# EAGLE design vfddriver (EAGLE 9.5.0)
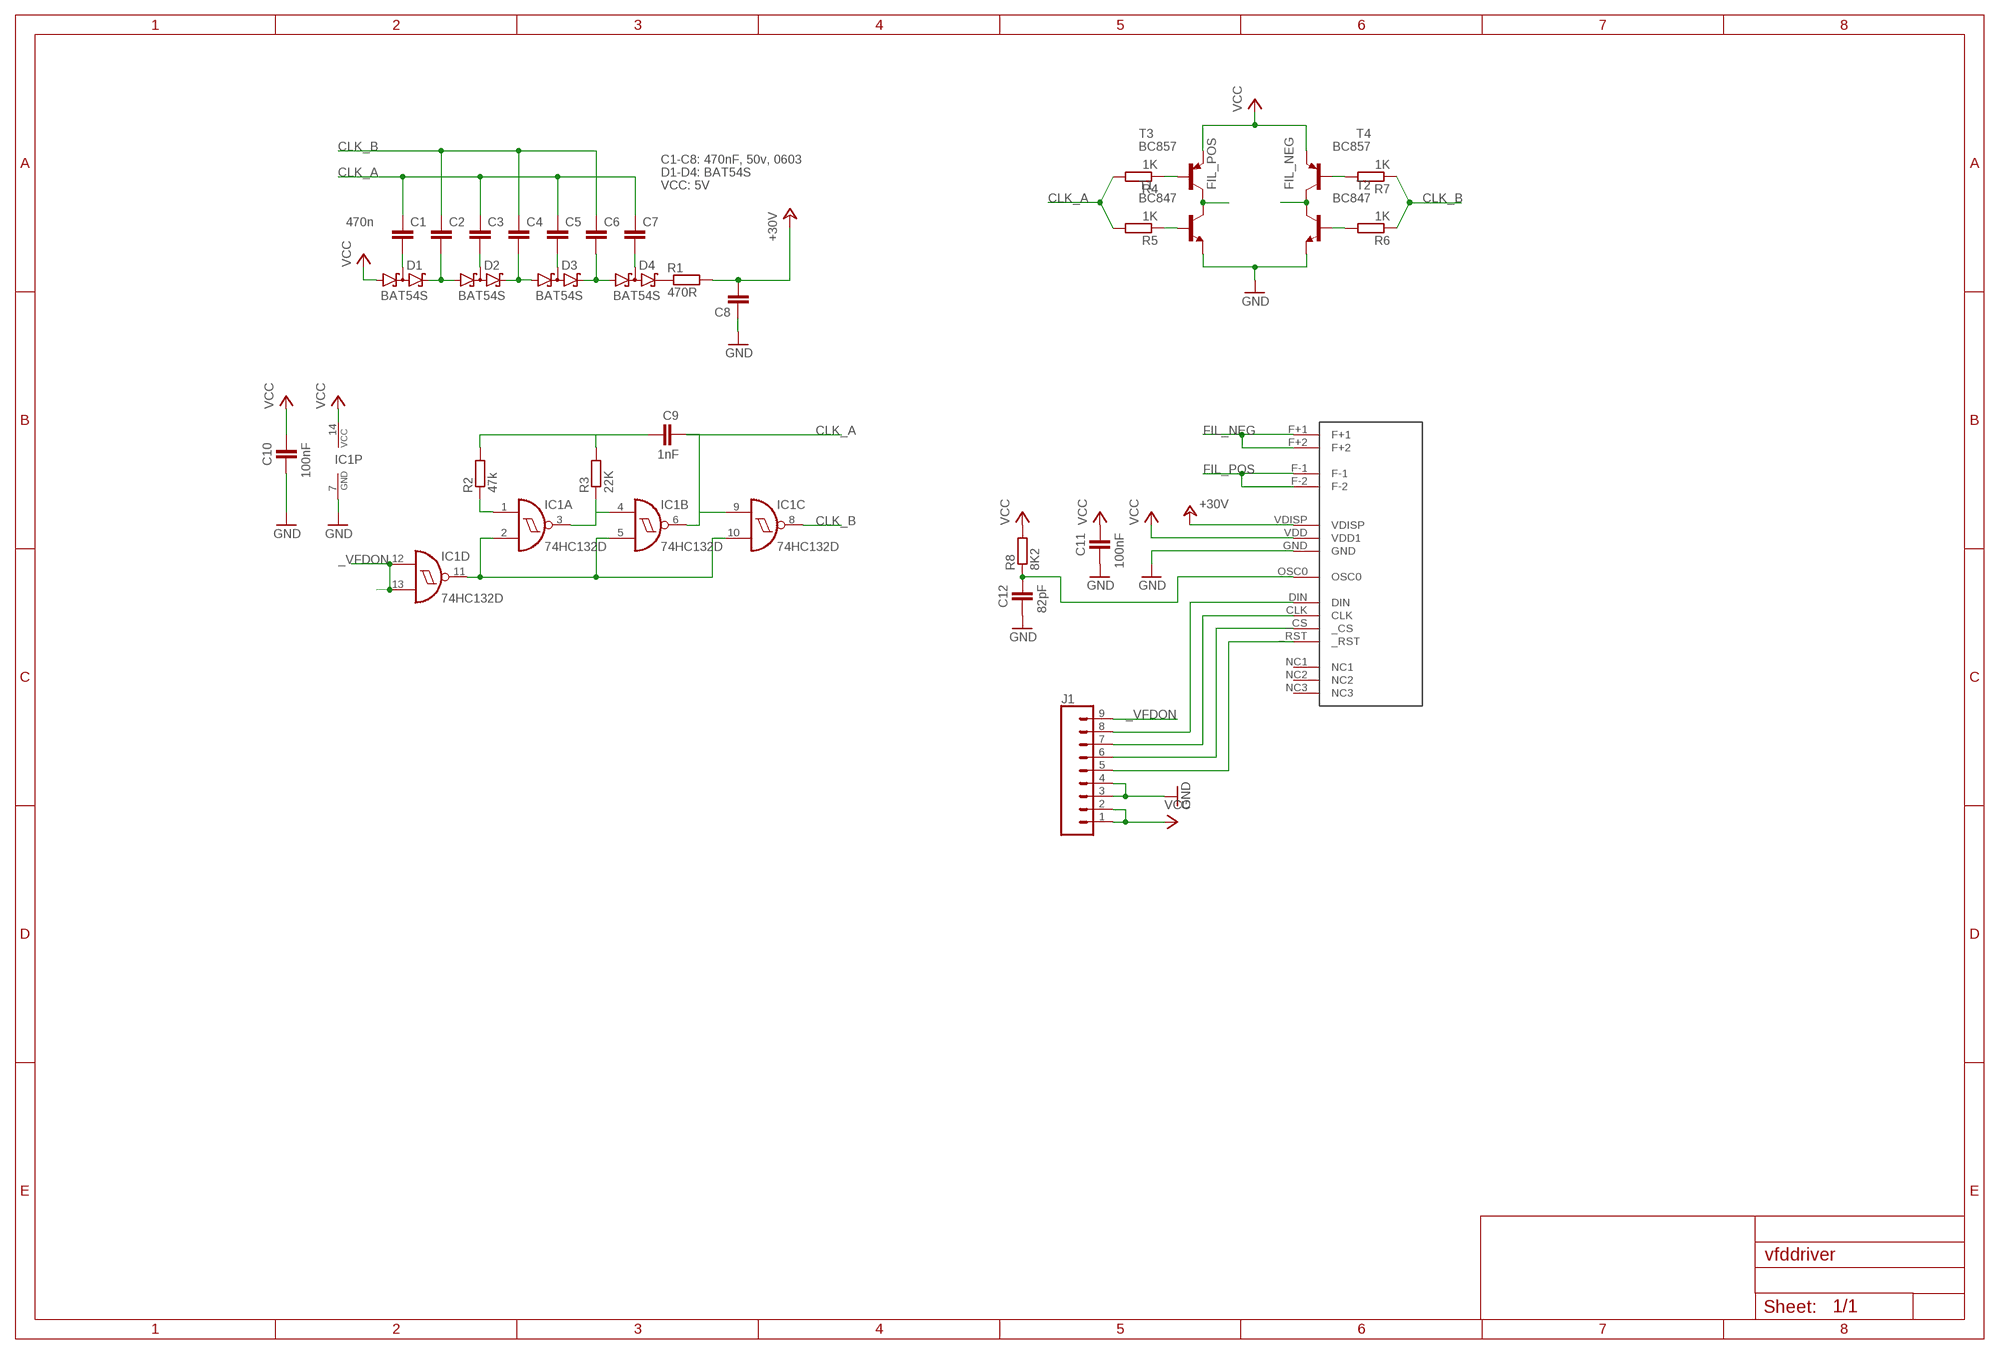
[diagram p0: schematic, sheet 1]

## Parts
C1  470n  C-EUC0603  [C0603]
C2  470n 50v  C-EUC0603  [C0603]
C3  470n 50v  C-EUC0603  [C0603]
C4  470n 50v  C-EUC0603  [C0603]
C5  470n 50v  C-EUC0603  [C0603]
C6  470n  C-EUC0603  [C0603]
C7  470n 50v  C-EUC0603  [C0603]
C8  470n  C-EUC0603  [C0603]
C9  1nF  C-EUC0603  [C0603]
C10  100nF  C-EUC0603  [C0603]
C11  100nF  C-EUC0603  [C0603]
C12  82pF  C-EUC0603  [C0603]
D1  BAT54S  [SOT23]
D2  BAT54S  [SOT23]
D3  BAT54S  [SOT23]
D4  BAT54S  [SOT23]
IC1  74HC132D  [SO14]
J1  CONN_09LONGPADS  [1X09_LONGPADS]
R1  470R  R-EU_R0603  [R0603]
R2  47k  R-EU_R0603  [R0603]
R3  22K  R-EU_R0603  [R0603]
R4  1K  R-EU_R0603  [R0603]
R5  1K  R-EU_R0603  [R0603]
R6  1K  R-EU_R0603  [R0603]
R7  1K  R-EU_R0603  [R0603]
R8  8K2  R-EU_R0603  [R0603]
T1  BC847  [SOT23]
T2  BC847  [SOT23]
T3  BC857  BC857A-PNP-SOT23-BEC  [SOT23-BEC]
T4  BC857  BC857A-PNP-SOT23-BEC  [SOT23-BEC]
U$1  SAMSUNGHCS-12SS59T  [SAMSUNGHCS-12SS59T]

## Nets
+24V: C8.2 R1.2 U$1.VDISP ; supply symbol labelled +30V
_VFDON: IC1.12(D:I0) IC1.13(D:I1) J1.9
CLK_A: C1.1 C3.1 C5.1 C7.1 C9.2 IC1.6(B:O) IC1.9(C:I0) R4.2 R5.2
CLK_B: C2.1 C4.1 C6.1 IC1.8(C:O) R6.1 R7.1
FIL_NEG: T2.3(C) T4.C U$1.F+1 U$1.F+2
FIL_POS: T1.3(C) T3.C U$1.F-1 U$1.F-2
GND: C8.1 C10.1 C11.1 C12.1 IC1.7(P:GND) J1.3 J1.4 T1.2(E) T2.2(E) U$1.GND
N$1: C2.2 D1.2(C2) D2.1(A1)
N$2: C4.2 D2.2(C2) D3.1(A1)
N$3: C6.2 D3.2(C2) D4.1(A1)
N$4: C5.2 D3.3(C1A2)
N$5: D4.2(C2) R1.1
N$6: C1.2 D1.3(C1A2)
N$7: C3.2 D2.3(C1A2)
N$8: C7.2 D4.3(C1A2)
N$9: R4.1 T3.B
N$10: IC1.1(A:I0) R2.1
N$11: C9.1 R2.2 R3.2
N$12: IC1.3(A:O) IC1.4(B:I0) R3.1
N$13: R5.1 T1.1(B)
N$14: R7.2 T4.B
N$15: R6.2 T2.1(B)
N$16: C12.2 R8.1 U$1.OSC0
N$17: J1.8 U$1.DIN
N$18: IC1.2(A:I1) IC1.5(B:I1) IC1.10(C:I1) IC1.11(D:O)
N$19: J1.7 U$1.CLK
N$22: J1.6 U$1._CS
N$23: J1.5 U$1._RST
VCC: C10.2 C11.2 D1.1(A1) IC1.14(P:VCC) J1.1 J1.2 R8.2 T3.E T4.E U$1.VDD(VDD1)
Unconnected: U$1.NC1 U$1.NC2 U$1.NC3

## Notes on the sheet
- C1-C8: 470nF, 50v, 0603
- D1-D4: BAT54S
- VCC: 5V

## Library data of the parts
C1-C12 = rcl:C-EU: CAPACITOR, European symbol; SPICEPREFIX: C
D1-D4 = diode:BAT54S: Schottky Diodes Pin connection corrected 2011-05-04 Source: Fairchild .. BAT54.pdf
IC1 = 74xx-eu:74*132: Quad 2-input NAND schmitt trigger
J1 = SparkFun-Connectors:CONN_09: Multi connection point. Often used as Generic Header-pin footprint for 0.1 inch spaced/style header connections On any of the 0.1 inch spaced packages, you can populate with these: Break Away Headers - Straight <https://www.sparkfun.com/products/116> (PRT-00116) Break Away Male Headers - Right Angle <https://www.sparkfun.com/products/553> (PRT-00553) Female Headers <https://www.sparkfun.com/products/115> (PRT-00115) Break Away Headers - Machine Pin <https://www.sparkfun.com/products/117> (PRT-00117) Break Away Female Headers - Swiss Machine Pin <https://www.sparkfun.com/products/743> (PRT-00743) For SCREWTERMINALS and SPRING TERMINALS visit here: Screw Terimnals on SparkFun.com <https://www.sparkfun.com/search/results?term=Screw+Terminals> (5mm/3.5mm/2.54mm spacing) This device is also useful as a general connection point to wire up your design to another part of your project. Our various solder wires solder well into these plated through hole pads. Hook-Up Wire - Assortment (Stranded, 22 AWG) <https://www.sparkfun.com/products/11375> (PRT-11375) Hook-Up Wire - Assortment (Solid Core, 22 AWG) <https://www.sparkfun.com/products/11367> (PRT-11367) View the entire wire category on our website here <https://www.sparkfun.com/categories/141> Special notes: Molex polarized connector foot print use with SKU : PRT-08231 with associated crimp pins and housings. 1MM SMD Version SKU: PRT-10208 NOTES ON THE VARIANTS LOCK and LOCK_LONGPADS... This footprint was designed to help hold the alignment of a through-hole component (i.e. 6-pin header) while soldering it into place. You may notice that each hole has been shifted either up or down by 0.005 of an inch from it's more standard position (which is a perfectly straight line). This slight alteration caused the pins (the squares in the middle) to touch the edges of the holes. Because they are alternating, it causes a "brace" to hold the component in place. 0.005 has proven to be the perfect amount of "off-center" position when using our standard breakaway headers. Although looks a little odd when you look at the bare footprint, once you have a header in there, the alteration is very hard to notice. Also,if you push a header all the way into place, it is covered up entirely on the bottom side.
R1-R8 = rcl:R-EU_: RESISTOR, European symbol; SPICEPREFIX: R
T1 T2 = transistor:BC847: NPN TRANSISTOR
T3 T4 = transistor:*-PNP-: PNP Transistror
U$1 = samsung_vfd_HCS_12SS59T:SAMSUNGHCS-12SS59T

## Board
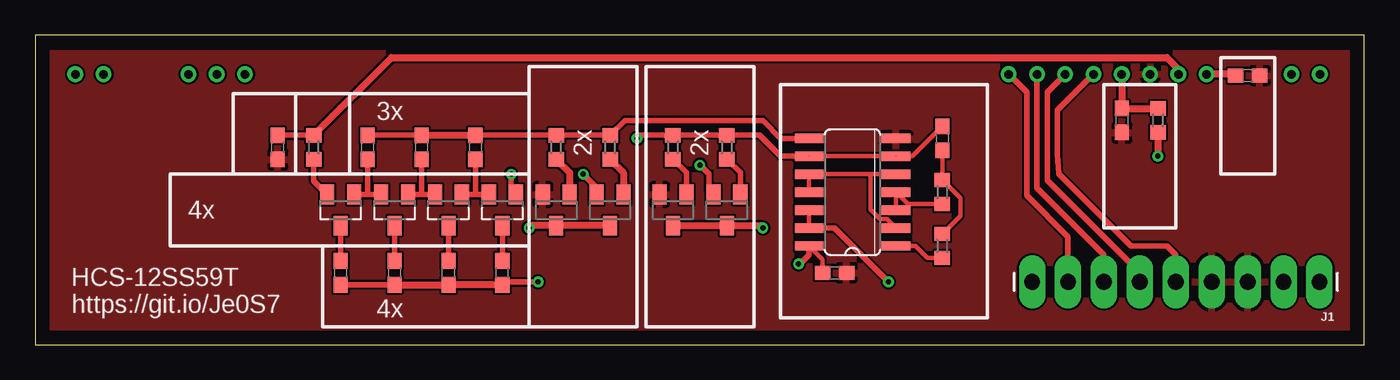
[diagram p1: board, top side]
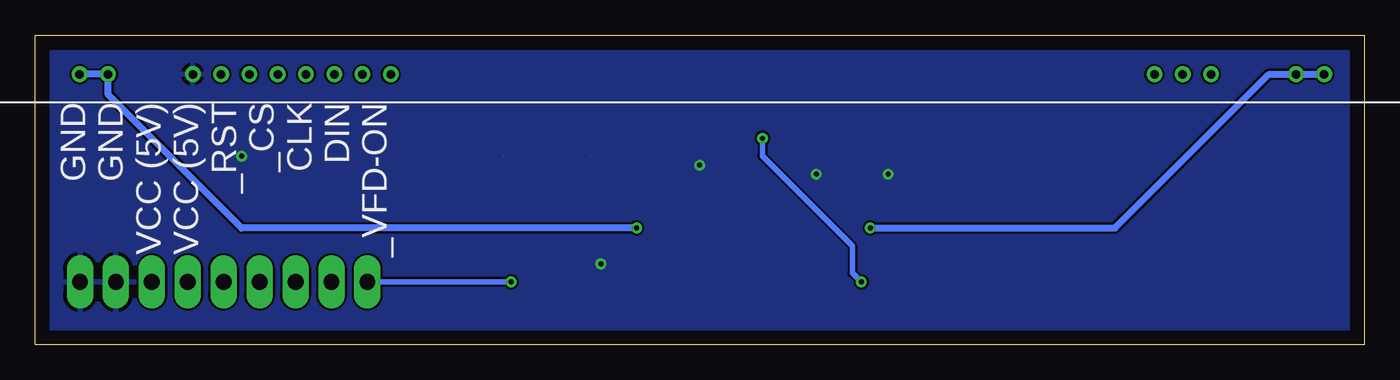
[diagram p2: board, bottom side, seen from below]

Size 93.96 x 21.89 mm. Coordinates in mm from the lower left corner, seen from the top.
Outline: 0,0 93.96,0 93.96,21.89 0,21.89 0,0
Copper layers (1*16): Top 0.035mm / dielectric 0.15mm / Bottom 0.035mm
Design rules "default": minimum track width 6mil, minimum drill 0.35mm, track to track 6mil, track to pad 6mil, pad to pad 6mil, via to via 6mil, smd to smd 6mil, copper to edge 40mil, drill to drill 6mil, minimum pad ring 10mil, minimum via ring 8mil, stop-mask expansion 4mil, vias tented up to drill 0mil, thermal gap 10mil

### Footprints (pad centres in the part's own frame; a part is rotated, then mirrored left to right if it is on the bottom)
C0603 = smd 1.1 x 1: 1 -0.85,0; 2 0.85,0
SOT23 = smd 1 x 1.4: 1 -0.95,-1.1; 2 0.95,-1.1; 3 0,1.1
SO14 = smd 0.66 x 2.032: 1 -3.81,-3.073; 2 -2.54,-3.073; 3 -1.27,-3.073; 4 0,-3.073; 5 1.27,-3.073; 6 2.54,-3.073; 7 3.81,-3.073; 8 3.81,3.073; 9 2.54,3.073; 10 1.27,3.073; 11 0,3.073; 12 -1.27,3.073; 13 -2.54,3.073; 14 -3.81,3.073
1X09_LONGPADS = drill 1.118 pad 1.88 long: 1 0,0; 2 2.54,0; 3 5.08,0; 4 7.62,0; 5 10.16,0; 6 12.7,0; 7 15.24,0; 8 17.78,0; 9 20.32,0
R0603 = smd 1 x 1.1: 1 -0.85,0; 2 0.85,0
SOT23-BEC = smd 1 x 1.4: B -0.95,-1.1; C 0,1.1; E 0.95,-1.1
SAMSUNGHCS-12SS59T = drill 0.6: _CS 76,-2; _RST 78,-2; CLK 74,-2; DIN 72,-2; F+1 6,-2; F+2 8,-2; F-1 92,-2; F-2 94,-2; GND 82,-2; NC1 14,-2; NC2 16,-2; NC3 18,-2; OSC0 80,-2; VDD 86,-2; VDISP 84,-2

### Placement (x,y rotation side)
C1  33.02,5.08 90 top
C2  31.11,13.97 270 top
C3  29.21,5.08 90 top
C4  27.3,13.97 270 top
C5  25.4,5.08 90 top
C6  23.5,13.97 270 top
C7  21.59,5.08 90 top
C8  17.14,13.97 90 top
C9  64.14,14.61 90 top
C10  56.52,5.08 180 top
C11  85.72,19.05 180 top
C12  76.83,15.88 90 top
D1  33.02,9.53 180 top
D2  29.21,9.53 180 top
D3  25.4,9.53 180 top
D4  21.59,9.53 180 top
IC1  57.78,10.79 90 top
J1  90.81,4.45 180 top
R1  19.68,13.97 90 top
R2  64.14,6.99 90 top
R3  64.14,10.79 90 top
R4  48.9,13.97 90 top
R5  45.09,13.97 90 top
R6  36.83,13.97 270 top
R7  40.64,13.97 270 top
R8  79.38,15.88 270 top
T1  45.09,9.53 180 top
T2  36.83,9.53 180 top
T3  48.9,9.53 180 top
T4  40.64,9.53 180 top
U$1  -3.17,17.14 180 bottom

### Tracks (layer width: path | path; a pad name or v marks a point on that pad's centre or on a via)
+24V
  Top 0.406: C8.2 R1.2
  Top 0.508: R1.2 25.18,20.32 80.01,20.32 80.83,19.5 U$1.VDISP
_VFDON  (via drill 0.35)
  Top 0.305: IC1.12 IC1.13
  Top 0.406: IC1.13 56.52,8.26 v60.33,4.45
  Bottom 0.406: v60.33,4.45 J1.9
CLK_A  (via drill 0.35)  (2 unrouted)
  Top 0.305: C9.2 62.02,13.34 IC1.6 IC1.9
  Top 0.406: IC1.9 52.7,13.34 51.22,14.82 R4.2 R5.2 42.76,14.82 v42.55,14.61 | C1.1 33.23,4.45 v35.56,4.45 | C5.1 C7.1
  Top 0.508: C5.1 C3.1 C1.1
  Bottom 0.406: v35.56,4.45 36.2,5.08 36.2,6.99 42.55,13.34 v42.55,14.61
CLK_B
  Top 0.406: IC1.8 52.7,14.61 51.44,15.88 41.7,15.88 R7.1 R6.1 C2.1 | C6.1 C4.1
  Top 0.508: C4.1 C2.1
FIL_NEG  (via drill 0.35)
  Top 0.508: T4.C T2.3 35.09,8.43 v34.92,8.26
  Bottom 0.508: v34.92,8.26 17.62,8.26 6.73,19.14 U$1.F+2 U$1.F+1
FIL_POS  (via drill 0.35)
  Top 0.508: T1.3 T3.C 51.27,8.43 v51.44,8.26
  Bottom 0.508: v51.44,8.26 79.38,8.26 88.83,17.7 U$1.F-1 U$1.F-2
GND
  pour Top: 0.64,20.95 0.64,0.64 93.34,0.64 93.34,20.95
N$1
  Top 0.406: D1.2 31.11,10.62 | 31.11,10.62 D2.1 | C2.2 31.11,10.62
N$2
  Top 0.406: D2.2 27.3,10.62 | 27.3,10.62 D3.1 | C4.2 27.3,10.62
N$3
  Top 0.406: D3.2 23.5,10.62 | 23.5,10.62 D4.1 | C6.2 23.5,10.62
N$4
  Top 0.406: C5.2 D3.3
N$5
  Top 0.406: D4.2 19.68,11.58 R1.1
N$6
  Top 0.406: C1.2 D1.3
N$7
  Top 0.406: C3.2 D2.3
N$8
  Top 0.406: C7.2 D4.3
N$9
  Top 0.406: R4.1 49.84,12.17 T3.B
N$10
  Top 0.305: IC1.1 62.23,6.99 63.08,6.13 R2.1
N$11
  Top 0.305: R2.2 65.41,9.11 65.41,10.38 R3.2 C9.1
N$12
  Top 0.305: IC1.3 IC1.4 61.71,9.95 R3.1
N$13
  Top 0.406: R5.1 46.03,12.17 T1.1
N$14
  Top 0.508: R7.2 41.59,12.17 T4.B
N$15
  Top 0.508: R6.2 37.78,12.17 T2.1
N$16
  Top 0.508: U$1.OSC0 C12.2 R8.1
N$17
  Top 0.406: J1.8 73.03,7.62 70.09,10.55 70.09,17.88 U$1.DIN
N$18
  Top 0.305: IC1.5 59.05,12.06 | IC1.2 60.22,8.89 59.72,8.89 59.05,9.55 59.05,12.06 | IC1.11 IC1.10 59.05,12.06
N$19
  Top 0.406: J1.7 75.56,6.35 70.83,11.09 U$1.CLK
N$22
  Top 0.406: J1.6 78.11,5.08 71.56,11.63 71.56,17.88 U$1._CS
N$23
  Top 0.406: U$1._RST 72.28,16.61 72.28,13.44 72.39,12.06 77.47,6.99 80.01,6.99 80.64,6.35 J1.5
VCC  (via drill 0.35)
  Top 0.305: IC1.14 55.66,6.03 C10.2
  Top 0.406: T4.E 39.69,11.11 v38.73,12.06 | T3.E 47.62,10.95 47.62,12.06 v46.99,12.7 | IC1.14 54.71,6.35 54.08,5.71 v53.98,5.71 | D1.1 33.66,10.94 v33.66,12.06
  Top 0.508: C11.2 84.78,19.14 U$1.VDD | R8.2 v79.38,13.34
  pour Bottom: 0.64,20.95 0.64,0.64 93.34,0.64 93.34,20.95

### Text on the board
tPlace: 3x | 2x | 2x | 4x | HCS-12SS59T / https://git.io/Je0S7 | 4x
bPlace: GND / GND / VCC (5V) / VCC (5V) / _RST / _CS / CLK / DIN / _VFD-ON